# Altium schematic sheet Pinout_Sch.SchDoc
size A4
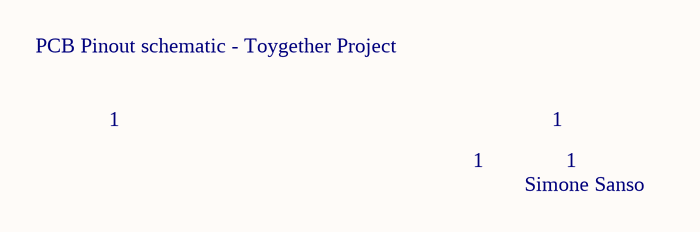
[diagram p0: Pinout_Sch.SchDoc]

## Notes on the sheet
- PCB Pinout schematic - Toygether Project
- 1
- Simone Sanso